# Altium schematic sheet MiniSub_Power_Board.SchDoc
size A
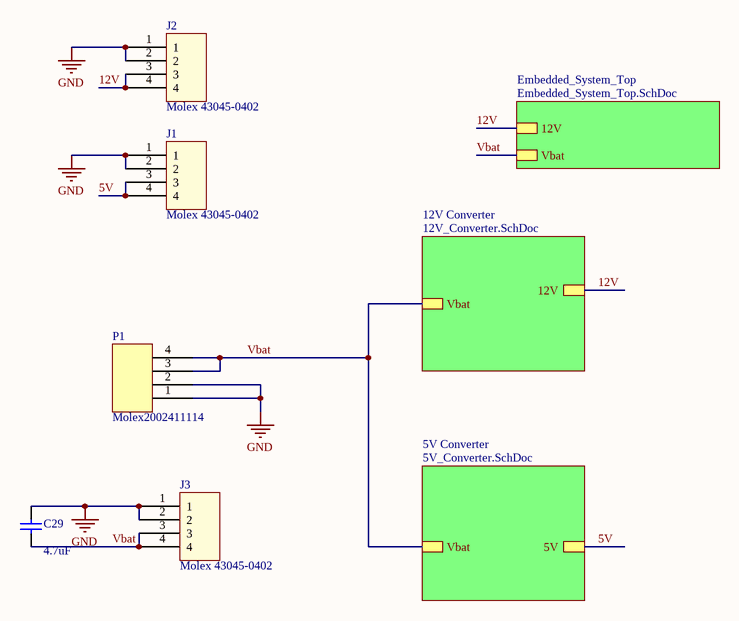
[diagram p0: MiniSub_Power_Board.SchDoc]

## Parts
C29  value 4.7uF  [C1210]  (hidden comment: HMK325C7475KN-TE)
J1  Molex 43045-0402  [Molex43045-0402]
J2  Molex 43045-0402  [Molex43045-0402]
J3  Molex 43045-0402  [Molex43045-0402]
P1  Molex2002411114  [Molex2002411114]

## Sub-sheets
5V Converter = 5V_Converter.SchDoc: Vbat, 5V
12V Converter = 12V_Converter.SchDoc: Vbat, 12V
Embedded_System_Top = Embedded_System_Top.SchDoc: 12V, Vbat

## Nets
GND: C29.2 J1.1 J1.2 J2.1 J2.2 J3.1 J3.2 P1.1 P1.2
5V: J1.3 J1.4 ; sheet 5V Converter/5V
12V: J2.3 J2.4 ; sheet 12V Converter/12V, sheet Embedded_System_Top/12V
Vbat: C29.1 J3.3 J3.4 P1.3 P1.4 ; sheet 12V Converter/Vbat, sheet 5V Converter/Vbat, sheet Embedded_System_Top/Vbat

## Library data of the parts
C29 = Cap Semi: Capacitor (Semiconductor SIM Model); Published: 8-Jun-2000; LatestRevisionDate: 29-May-2009; LatestRevisionNote: IPC-7351 Footprint Added.; PackageReference: C1206; Publisher: Altium Limited; PackageDescription: Chip Capacitor; ComponentLink1Description: Datasheet; ComponentLink1URL: https://www.yuden.co.jp/productdata/catalog/mlcc06_e.pdf; ComponentLink2Description: Digi-Key; ComponentLink2URL: https://www.digikey.com/product-detail/en/taiyo-yuden/HMK325C7475KN-TE/587-5038-1-ND/6563881
J1-J3 = Molex43045-0402: Micro-Fit 3.0 Right Angle Header, 3.00mm Pitch, Dual Row, 4 Circuits, with Snap-in Plastic Peg PCB Lock, Gold, Glow Wire Capable, Black; ComponentLink1Description: Molex Website; ComponentLink1URL: https://www.molex.com/molex/products/datasheet.jsp?part=active/0430450402_PCB_HEADERS.xml